# EAGLE design PlantComputerEsp8266 (EAGLE 9.5.0)
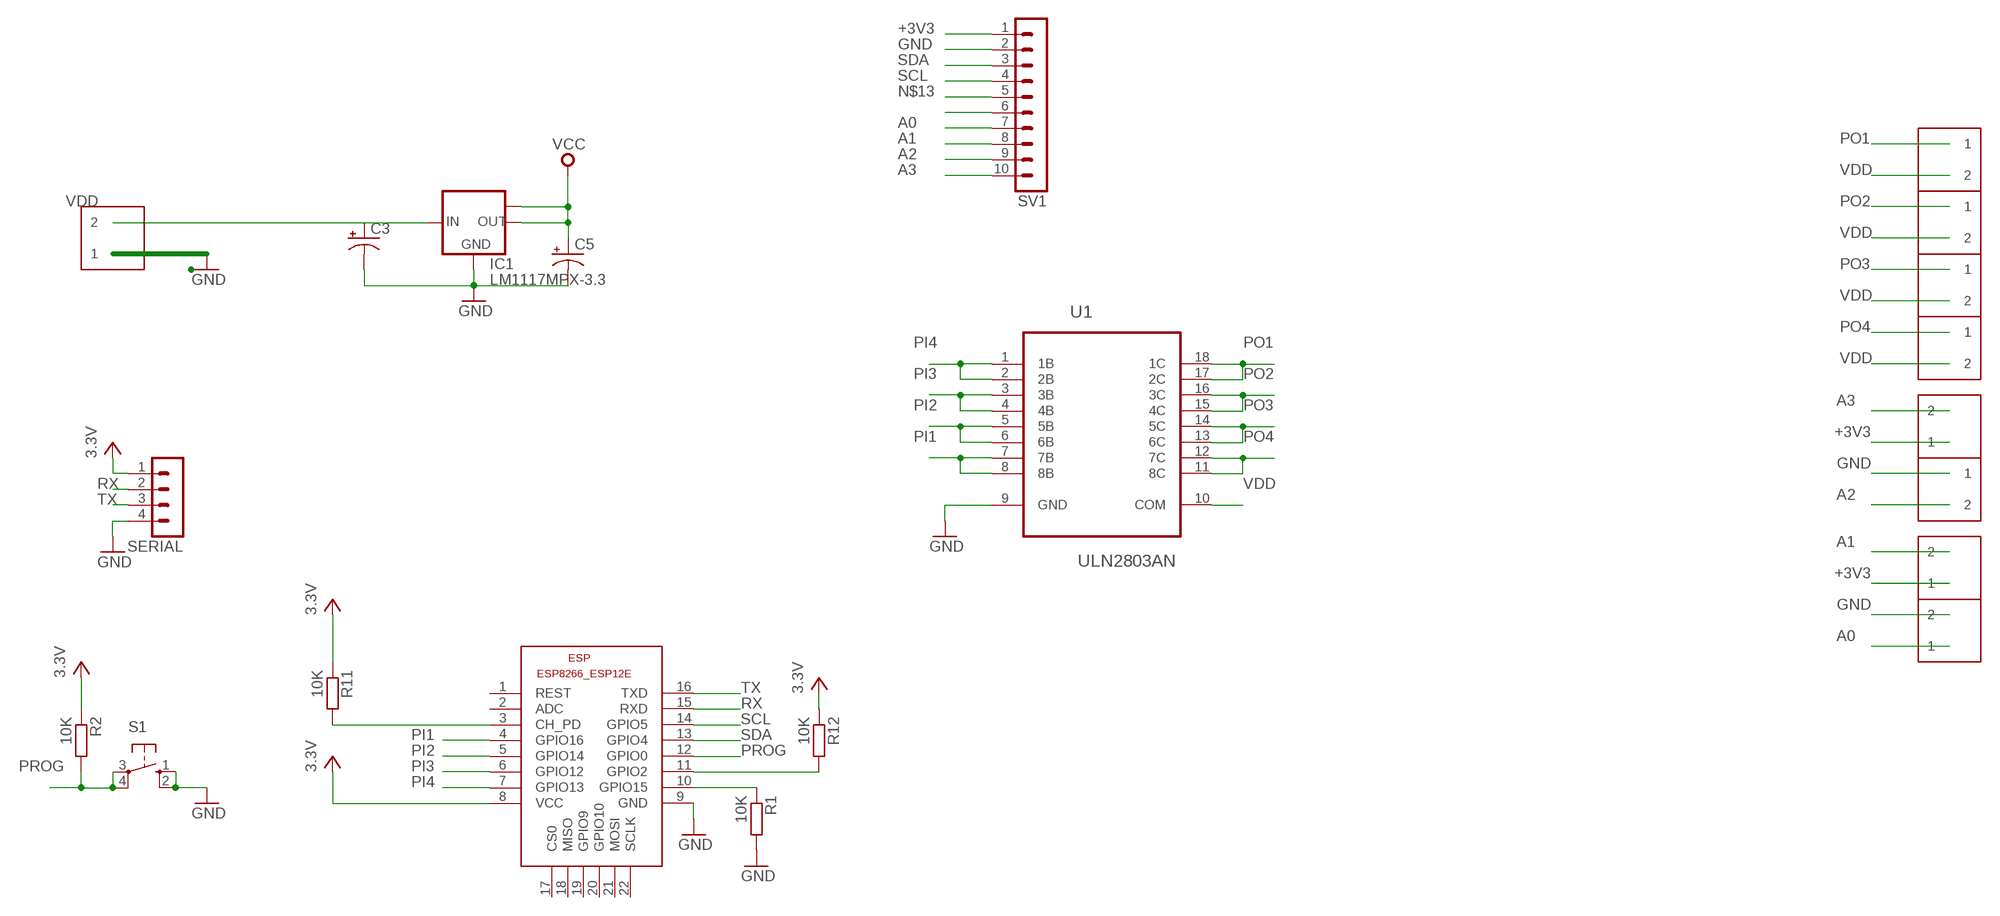
[diagram p0: schematic, sheet 1]

## Parts
C3  100UF-25V-20%(PTH)  [CPOL-RADIAL-100UF-25V]
C5  100UF-25V-20%(PTH)  [CPOL-RADIAL-100UF-25V]
ESP  ESP8266-12EESP8266-ESP12E  [ESP8266-ESP12E]
IC1  LM1117MPX-3.3  [SOT223]
PWR_IN  KF350-P2  [KF350-2P]
PWR_IN2  KF350-P2  [KF350-2P]
PWR_IN4  KF350-P2  [KF350-2P]
PWR_IN5  KF350-P2  [KF350-2P]
PWR_IN6  KF350-P2  [KF350-2P]
PWR_IN7  KF350-P2  [KF350-2P]
PWR_IN8  KF350-P2  [KF350-2P]
PWR_IN9  KF350-P2  [KF350-2P]
PWR_IN10  KF350-P2  [KF350-2P]
R1  10K  R-EU_R0603  [R0603]
R2  10K  R-EU_R0603  [R0603]
R11  10K  R-EU_R0603  [R0603]
R12  10K  R-EU_R0603  [R0603]
S1  10-XX  [B3F-10XX]
SERIAL  MA04-1  [MA04-1]
SV1  MA10-1  [MA10-1]
U1  ULN2803AN  [DIP254P762X393-18]

## Nets
+3V3: C5.1(+) ESP.8(VCC) IC1.2(OUT) IC1.TAB(OUT1) PWR_IN5.1 PWR_IN10.1 R2.1 R11.1 R12.1 SERIAL.1 SV1.1 ; supply symbol labelled VCC, 3.3V
A0: PWR_IN2.1 SV1.7
A1: PWR_IN10.2 SV1.8
A2: PWR_IN6.2 SV1.9
A3: PWR_IN5.2 SV1.10
GND: C3.2(-) C5.2(-) ESP.9(GND) IC1.1(GND) PWR_IN2.2 PWR_IN6.1 PWR_IN.1 R1.2 S1.1(S) S1.2(S1) SERIAL.4 SV1.2 U1.9(GND)
N$2: ESP.10(GPIO15) R1.1
N$3: ESP.3(CH_PD) R11.2
N$4: ESP.11(GPIO2) R12.2
N$9: SV1.6
N$13: SV1.5
PI1: ESP.4(GPIO16) U1.7(7B) U1.8(8B)
PI2: ESP.5(GPIO14) U1.5(5B) U1.6(6B)
PI3: ESP.6(GPIO12) U1.3(3B) U1.4(4B)
PI4: ESP.7(GPIO13) U1.1(1B) U1.2(2B)
PO1: PWR_IN4.1 U1.17(2C) U1.18(1C)
PO2: PWR_IN8.1 U1.15(4C) U1.16(3C)
PO3: PWR_IN9.1 U1.13(6C) U1.14(5C)
PO4: PWR_IN7.1 U1.11(8C) U1.12(7C)
PROG: ESP.12(GPIO0) R2.2 S1.3(P) S1.4(P1)
RX: ESP.15(RXD) SERIAL.2
SCL: ESP.14(GPIO5) SV1.4
SDA: ESP.13(GPIO4) SV1.3
TX: ESP.16(TXD) SERIAL.3
VDD: C3.1(+) IC1.3(IN) PWR_IN4.2 PWR_IN7.2 PWR_IN8.2 PWR_IN9.2 PWR_IN.2 U1.10(COM)
Unconnected: ESP.1(REST) ESP.2(ADC) ESP.17(CS0) ESP.18(MISO) ESP.19(GPIO9) ESP.20(GPIO10) ESP.21(MOSI) ESP.22(SCLK)

## Library data of the parts
C3 C5 = SparkFun-Capacitors:100UF-25V-20%(PTH): CAP-08439; PROD_ID: CAP-08439
ESP = ESP8266-ESP12E:ESP8266-12E: ESP8266-12E with additional I/O and GPIO04/05 corrected The author cannot warrant that this library is free from error or will meet your specific requirements. Created by PuceBaboon.com. Komagane, Nagano, JAPAN
IC1 = lm1117:LM1117MPX-*
PWR_IN PWR_IN2 PWR_IN4-PWR_IN10 = KF350-P2:KF350-P2
R1 R2 R11 R12 = resistor:R-EU_: RESISTOR, European symbol
S1 = switch-omron:10-XX: OMRON SWITCH; MPN: B3F-1000; OC_FARNELL: 176432; OC_NEWARK: 36M3542
SERIAL = con-lstb:MA04-1: PIN HEADER; OC_FARNELL: unknown; OC_NEWARK: unknown
SV1 = con-lstb:MA10-1: PIN HEADER; OC_FARNELL: unknown; OC_NEWARK: unknown
U1 = uln2803:ULN2803AN: Darlington transistor array; MPN: ULN2803AN; OC_FARNELL: 1652422; OC_NEWARK: 21J9298; PACKAGE: DIP-18; SUPPLIER: TEXAS INSTRUMENTS

## Net classes
1 +3v3: width 0.406 mm
2 GND: width 0.406 mm

## Board
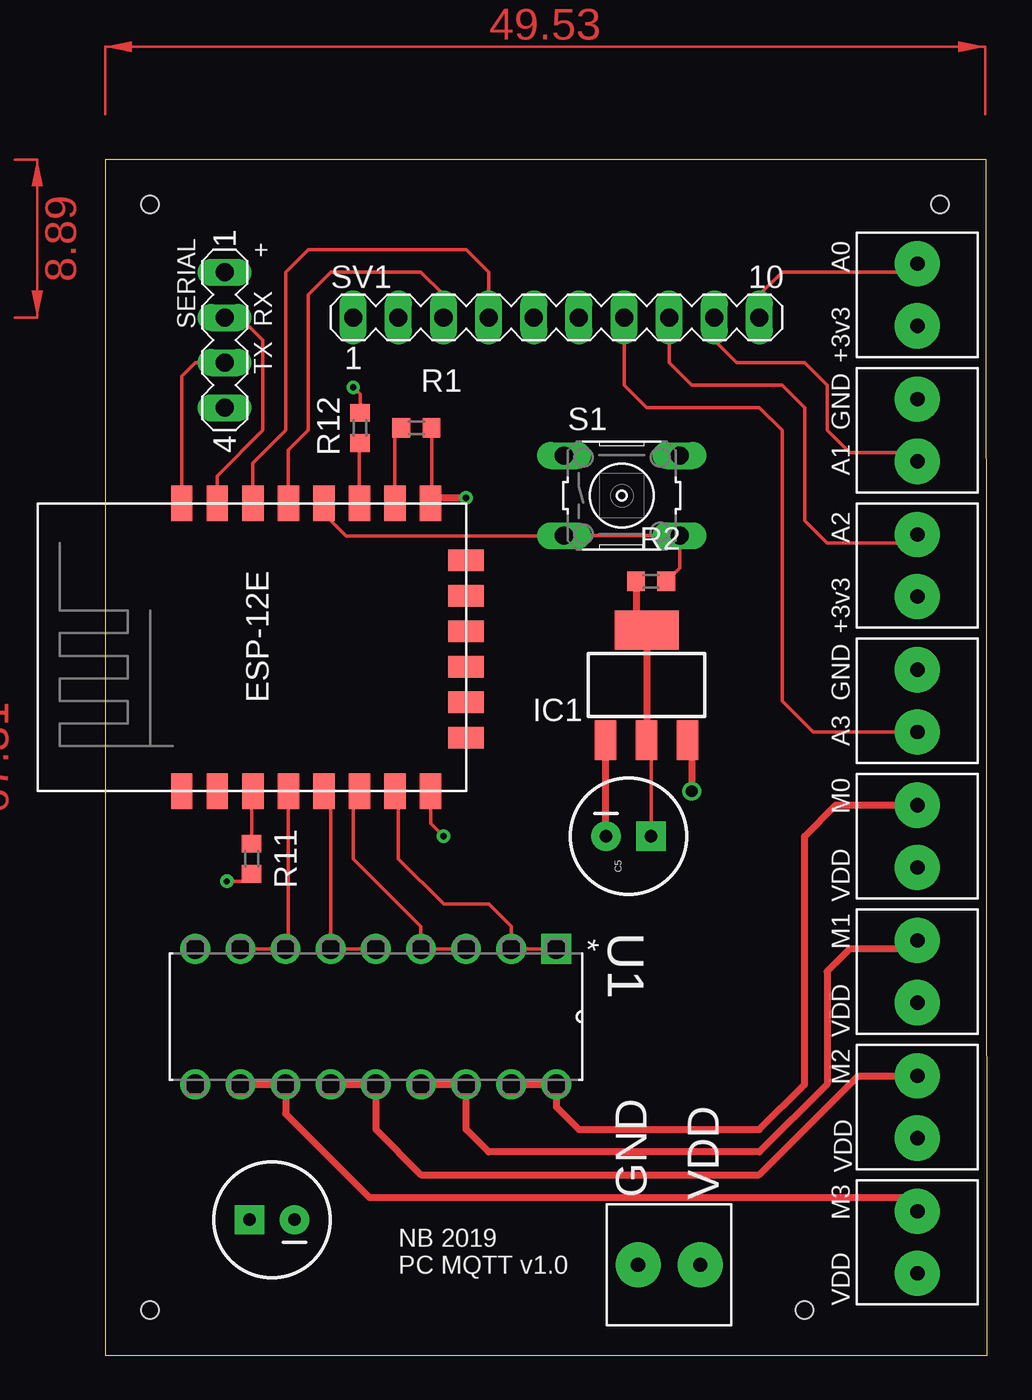
[diagram p1: board, top side]
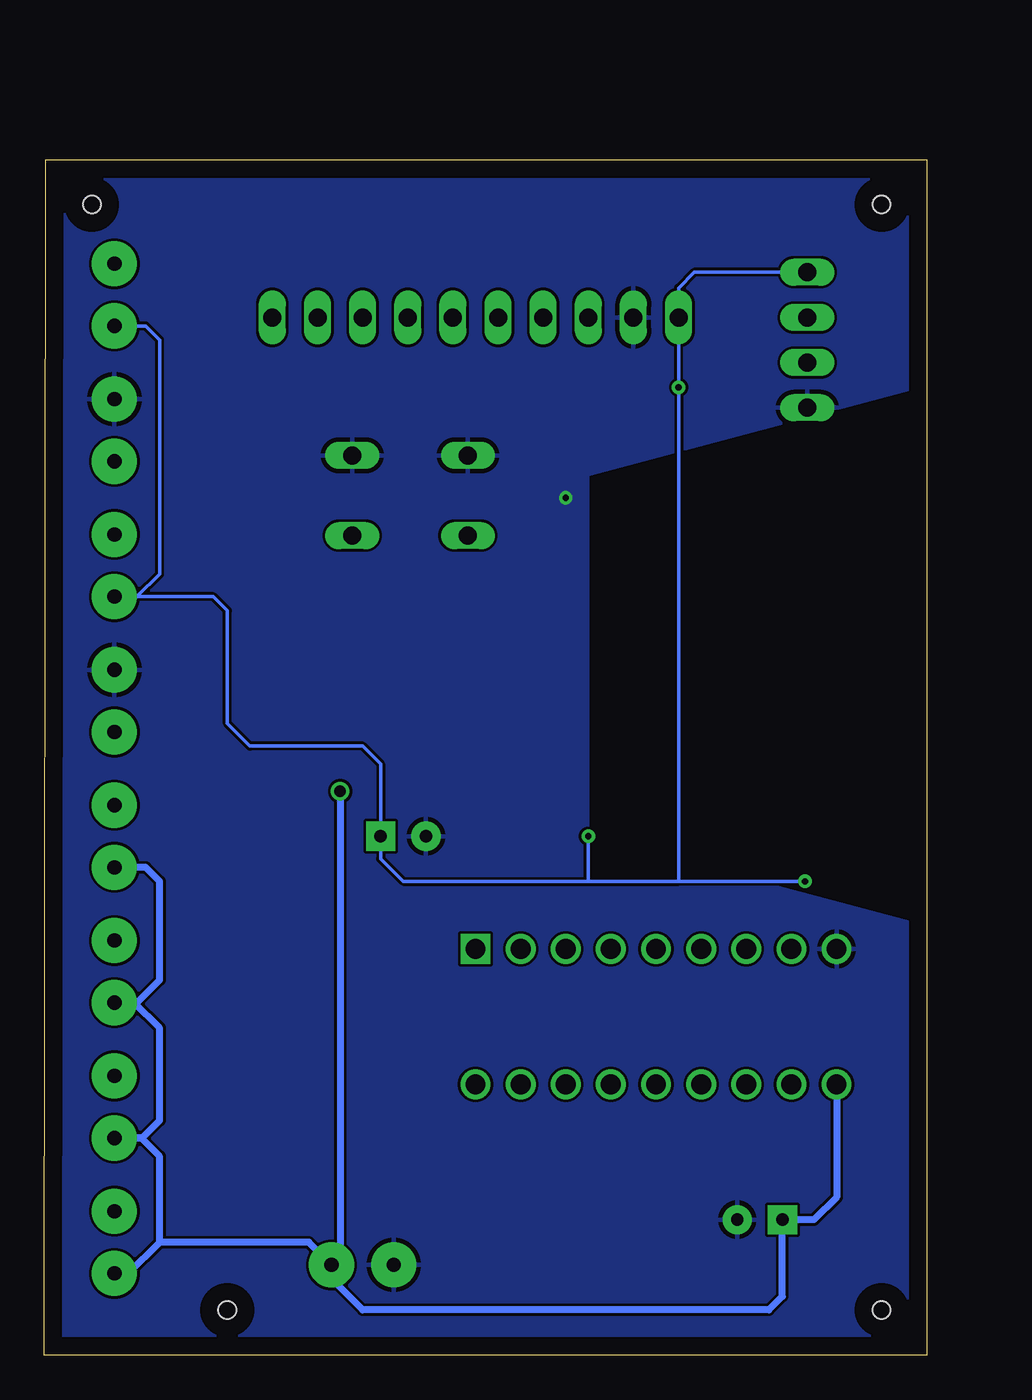
[diagram p2: board, bottom side, seen from below]

Size 49.66 x 67.3 mm. Coordinates in mm from the lower left corner, seen from the top.
Outline: 0,0 49.66,0 49.58,67.3 0,67.3 0,0
Copper layers (1*16): Top 0.035mm / dielectric 1.5mm / Bottom 0.035mm
Design rules "default": minimum track width 6mil, minimum drill 0.35mm, track to track 6mil, track to pad 6mil, pad to pad 6mil, via to via 6mil, smd to smd 6mil, copper to edge 40mil, drill to drill 6mil, minimum pad ring 10mil, minimum via ring 8mil, stop-mask expansion 4mil, vias tented up to drill 0mil, thermal gap 10mil
Holes 1 mm at 2.54,64.77 46.99,64.77 2.54,2.54 39.37,2.54

### Footprints (pad centres in the part's own frame; a part is rotated, then mirrored left to right if it is on the bottom)
CPOL-RADIAL-100UF-25V = drill 0.7 pad 1.651 square: 1 1.27,0 | drill 0.7 pad 1.651: 2 -1.27,0
ESP8266-ESP12E = smd 2 x 1.2: 1 -7.62,5.84; 2 -7.62,3.84; 3 -7.62,1.84; 4 -7.62,-0.16; 5 -7.62,-2.16; 6 -7.62,-4.16; 7 -7.62,-6.16; 8 -7.62,-8.16; 9 8.58,-8.16; 10 8.58,-6.16; 11 8.58,-4.16; 12 8.58,-2.16; 13 8.58,-0.16; 14 8.58,1.84; 15 8.58,3.84; 16 8.58,5.84 | smd 1.2 x 2: 17 -4.62,-10.16; 18 -2.62,-10.16; 19 -0.62,-10.16; 20 1.38,-10.16; 21 3.38,-10.16; 22 5.38,-10.16
SOT223 = smd 1.219 x 2.235: 1 -2.311,-3.099; 2 0,-3.099; 3 2.311,-3.099 | smd 3.6 x 2.2: TAB 0,3.099
KF350-2P = drill 0.8 pad 2.54: 1 -1.75,0; 2 1.75,0
R0603 = smd 1 x 1.1: 1 -0.85,0; 2 0.85,0
B3F-10XX = drill 1.016 long: 1 -3.251,2.261; 2 3.251,2.261; 3 -3.251,-2.261; 4 3.251,-2.261
MA04-1 = drill 1.016 long: 1 -3.81,0; 2 -1.27,0; 3 1.27,0; 4 3.81,0
MA10-1 = drill 1.016 long: 1 -11.43,0; 2 -8.89,0; 3 -6.35,0; 4 -3.81,0; 5 -1.27,0; 6 1.27,0; 7 3.81,0; 8 6.35,0; 9 8.89,0; 10 11.43,0
DIP254P762X393-18 = drill 1.118 square: 1 -7.62,20.32 | drill 1.118: 2 -7.62,17.78; 3 -7.62,15.24; 4 -7.62,12.7; 5 -7.62,10.16; 6 -7.62,7.62; 7 -7.62,5.08; 8 -7.62,2.54; 9 -7.62,0; 10 0,0; 11 0,2.54; 12 0,5.08; 13 0,7.62; 14 0,10.16; 15 0,12.7; 16 0,15.24; 17 0,17.78; 18 0,20.32

### Placement (x,y rotation side)
C3  9.4,7.62 180 top
C5  29.46,29.21 0 top
ESP  10.16,39.37 90 top
IC1  30.48,37.72 0 top
PWR_IN  31.75,5.08 0 top
PWR_IN2  45.72,36.83 90 top
PWR_IN4  45.72,29.21 270 top
PWR_IN5  45.72,59.69 90 top
PWR_IN6  45.72,52.07 270 top
PWR_IN7  45.72,6.35 270 top
PWR_IN8  45.72,21.59 270 top
PWR_IN9  45.72,13.97 270 top
PWR_IN10  45.72,44.45 90 top
R1  17.53,52.2 0 top
R2  30.73,43.56 0 top
R11  8.25,27.94 90 top
R12  14.35,52.2 270 top
S1  29.08,48.39 0 top
SERIAL  6.73,57.15 270 top
SV1  25.4,58.42 0 top
U1  5.08,15.24 270 top

### Tracks (layer width: path | path; a pad name or v marks a point on that pad's centre or on a via)
+3V3  (via drill 0.35)
  Top 0.203: IC1.2 30.73,34.37 C5.1 | v19.05,29.21 18.32,29.94 ESP.8 | v13.97,54.48 14.35,54.1 R12.1 | R11.1 7.83,26.67 v6.86,26.67
  Top 0.406: R2.1 29.88,41.31 29.21,40.64 30.3,40.64 IC1.TAB IC1.2
  Bottom 0.203: SERIAL.1 13.08,60.96 13.97,60.07 SV1.1 v13.97,54.48 13.97,26.67 | 19.05,26.67 29.46,26.67 30.73,27.94 C5.1 30.73,33.27 31.75,34.29 38.1,34.29 39.37,35.56 39.37,41.91 40.16,42.7 PWR_IN10.1 44.45,42.7 43.18,43.97 43.18,57.15 43.97,57.94 PWR_IN5.1 | 19.05,26.67 13.97,26.67 | 19.05,26.67 v19.05,29.21 | v6.86,26.67 13.97,26.67
A0
  Top 0.203: SV1.7 29.21,54.61 30.48,53.34 36.83,53.34 38.1,52.07 38.1,36.83 39.85,35.08 PWR_IN2.1
A1
  Top 0.203: SV1.8 31.75,55.88 33.02,54.61 38.1,54.61 39.37,53.34 39.37,46.99 40.64,45.72 45.24,45.72 PWR_IN10.2
A2
  Top 0.203: PWR_IN6.2 45.24,50.8 41.91,50.8 40.64,52.07 40.64,54.61 39.37,55.88 35.56,55.88 34.29,57.15 SV1.9
A3
  Top 0.203: PWR_IN5.2 45.24,60.96 38.1,60.96 36.83,59.69 SV1.10
GND  (via drill 0.35)
  Top 0.152: 18.32,48.26 ESP.9
  Top 0.203: R1.2 18.38,48.32 18.32,48.26
  Top 0.406: v20.32,48.26 18.43,48.26 18.38,48.32 | C5.2 28.17,29.23 IC1.1
  pour Bottom: 0,67.31 49.53,67.31 49.53,0 0,0 0,24.13 19.05,29.21 19.05,49.53 0,54.61
N$2
  Top 0.203: R1.1 16.32,51.84 ESP.10
N$3
  Top 0.203: R11.2 8.25,31.69 ESP.3
N$4
  Top 0.152: 14.32,51.32 R12.2
  Top 0.203: ESP.11 14.32,51.32
PI1
  Top 0.203: ESP.4 10.32,23.02 U1.7 U1.8
PI2
  Top 0.203: ESP.5 12.7,31.37 U1.6 U1.5
PI3
  Top 0.203: ESP.6 13.97,31.4 13.97,27.94 17.78,24.13 U1.4 U1.3
PI4
  Top 0.203: ESP.7 16.51,31.56 16.51,27.94 19.05,25.4 21.59,25.4 22.86,24.13 U1.2 U1.1
PO1
  Top 0.406: PWR_IN4.1 41.12,30.96 39.37,29.21 39.37,15.24 36.83,12.7 26.67,12.7 25.4,13.97 U1.18 U1.17
PO2
  Top 0.406: PWR_IN8.1 45.24,22.86 41.91,22.86 40.64,21.59 40.64,15.24 36.83,11.43 21.59,11.43 20.32,12.7 U1.16 U1.15
PO3
  Top 0.406: PWR_IN9.1 42.39,15.72 36.83,10.16 17.78,10.16 15.24,12.7 U1.14 U1.13
PO4
  Top 0.406: PWR_IN7.1 44.96,8.86 14.89,8.86 10.16,13.59 U1.12 U1.11
PROG
  Top 0.203: ESP.12 12.7,47.57 12.7,46.99 13.59,46.1 25.81,46.1 S1.3 S1.4 32.35,46.12 32.35,44.32 R2.2
RX
  Top 0.203: SERIAL.2 7.62,58.42 8.89,57.15 8.89,52.07 6.32,49.5 ESP.15
SCL
  Top 0.203: ESP.14 8.32,50.23 10.16,52.07 10.16,60.96 11.43,62.23 20.32,62.23 21.59,60.96 SV1.4
SDA
  Top 0.203: ESP.13 10.32,50.96 11.43,52.07 11.43,59.69 12.7,60.96 17.78,60.96 19.05,59.69 SV1.3
TX
  Top 0.203: ESP.16 4.32,55.12 5.08,55.88 SERIAL.3
VDD  (via drill 0.65)
  Top 0.406: IC1.3 33.02,34.39 v33.02,31.75
  Bottom 0.406: v33.02,31.75 33.02,5.56 PWR_IN.2 | U1.10 5.08,8.89 6.35,7.62 C3.1 8.13,3.3 8.89,2.54 31.75,2.54 33.5,4.29 PWR_IN.2 | PWR_IN4.2 43.97,27.46 43.18,26.67 43.18,21.11 44.45,19.84 PWR_IN8.2 44.6,19.84 43.18,18.41 43.18,13.21 44.17,12.22 PWR_IN9.2 44.22,12.22 43.18,11.18 43.18,6.35 | PWR_IN7.2 44.93,4.6 43.18,6.35 | PWR_IN.2 34.77,6.35 43.18,6.35
(copper drawn outside any net)
  shapes: Top area x3

### Text on the board
tPlace: + | SERIAL | RX | TX | NB 2019 / PC MQTT v1.0
tNames: A0 | +3v3 | GND | A1 | A2 | +3v3 | GND | A3 | M0 | VDD | M1 | VDD | M2 | VDD | GND | VDD | M3 | VDD